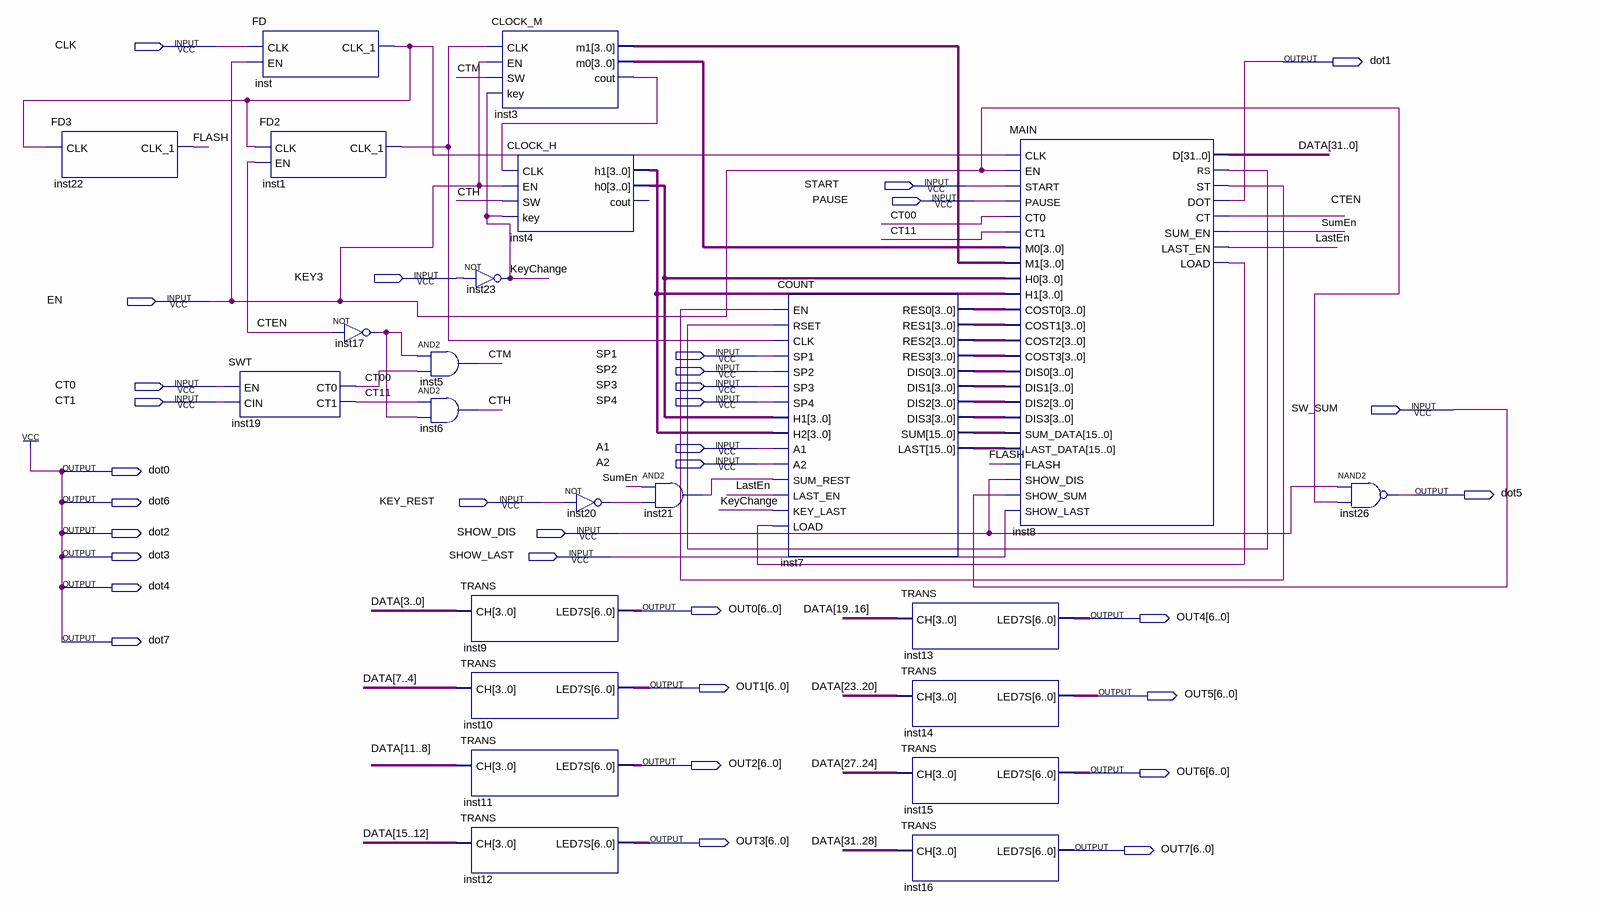
[diagram p0: schematic sheet]
// Quartus schematic taxi.bdf as structural Verilog: 23 symbols, 33 pins
module taxi (
  input  CLK,
  input  START,
  input  PAUSE,
  input  KEY3,
  input  EN,
  input  SP1,
  input  SP2,
  input  CT0,
  input  SP3,
  input  CT1,
  input  SP4,
  input  SW_SUM,
  input  A1,
  input  A2,
  input  KEY_REST,
  input  SHOW_DIS,
  input  SHOW_LAST,
  output dot1,
  output dot0,
  output dot5,
  output dot6,
  output dot2,
  output dot3,
  output dot4,
  output [6:0] OUT0,
  output [6:0] OUT4,
  output dot7,
  output [6:0] OUT1,
  output [6:0] OUT5,
  output [6:0] OUT2,
  output [6:0] OUT6,
  output [6:0] OUT3,
  output [6:0] OUT7
);

  wire CT00, CT11, CTEN, CTH, CTM, FLASH, inst1_clk_1, inst3_cout, inst8_load, inst8_rs, inst8_st,
       inst17_out, inst20_out, inst21_out, inst_clk_1, KeyChange, LastEn, SumEn;
  wire [3:0] inst3_m0, inst3_m1, inst4_h0, inst4_h1, inst7_dis0, inst7_dis1, inst7_dis2, inst7_dis3,
       inst7_res0, inst7_res1, inst7_res2, inst7_res3;
  wire [15:0] inst7_last, inst7_sum;
  wire [31:0] DATA;

  FD3 inst22 (.CLK(inst_clk_1), .CLK_1(FLASH));
  FD inst (.CLK(CLK), .EN(EN), .CLK_1(inst_clk_1));
  FD2 inst1 (.CLK(inst_clk_1), .EN(CTEN), .CLK_1(inst1_clk_1));
  SWT inst19 (.EN(CT0), .CIN(CT1), .CT0(CT00), .CT1(CT11));
  not inst17 (inst17_out, CTEN);
  and inst5 (CTM, inst17_out, CT00);
  and inst6 (CTH, CT11, inst17_out);
  CLOCK_M inst3 (
    .CLK(inst1_clk_1), .EN(EN), .SW(CTM), .key(KeyChange), .m1(inst3_m1), .m0(inst3_m0), .cout(inst3_cout));
  CLOCK_H inst4 (.CLK(inst3_cout), .EN(EN), .SW(CTH), .key(KeyChange), .h1(inst4_h1), .h0(inst4_h0));  // open: cout
  not inst23 (KeyChange, KEY3);
  TRANS inst9 (.CH(DATA[3:0]), .LED7S(OUT0));
  TRANS inst10 (.CH(DATA[7:4]), .LED7S(OUT1));
  TRANS inst11 (.CH(DATA[11:8]), .LED7S(OUT2));
  TRANS inst12 (.CH(DATA[15:12]), .LED7S(OUT3));
  not inst20 (inst20_out, KEY_REST);
  and inst21 (inst21_out, SumEn, inst20_out);
  COUNT inst7 (
    .EN(inst8_st), .RSET(inst8_rs), .CLK(inst1_clk_1), .SP1(SP1), .SP2(SP2), .SP3(SP3), .SP4(SP4),
    .H1(inst4_h0), .H2(inst4_h1), .A1(A1), .A2(A2), .SUM_REST(inst21_out), .LAST_EN(LastEn),
    .KEY_LAST(KeyChange), .LOAD(inst8_load), .RES0(inst7_res0), .RES1(inst7_res1), .RES2(inst7_res2),
    .RES3(inst7_res3), .DIS0(inst7_dis0), .DIS1(inst7_dis1), .DIS2(inst7_dis2), .DIS3(inst7_dis3),
    .SUM(inst7_sum), .LAST(inst7_last));
  TRANS inst13 (.CH(DATA[19:16]), .LED7S(OUT4));
  TRANS inst14 (.CH(DATA[23:20]), .LED7S(OUT5));
  TRANS inst15 (.CH(DATA[27:24]), .LED7S(OUT6));
  TRANS inst16 (.CH(DATA[31:28]), .LED7S(OUT7));
  MAIN inst8 (
    .CLK(inst_clk_1), .EN(EN), .START(START), .PAUSE(PAUSE), .CT0(CT00), .CT1(CT11), .M0(inst3_m0),
    .M1(inst3_m1), .H0(inst4_h0), .H1(inst4_h1), .COST0(inst7_res0), .COST1(inst7_res1), .COST2(inst7_res2),
    .COST3(inst7_res3), .DIS0(inst7_dis0), .DIS1(inst7_dis1), .DIS2(inst7_dis2), .DIS3(inst7_dis3),
    .SUM_DATA(inst7_sum), .LAST_DATA(inst7_last), .FLASH(FLASH), .SHOW_DIS(SHOW_DIS), .SHOW_SUM(SW_SUM),
    .SHOW_LAST(SHOW_LAST), .D(DATA), .RS(inst8_rs), .ST(inst8_st), .DOT(dot1), .CT(CTEN), .SUM_EN(SumEn),
    .LAST_EN(LastEn), .LOAD(inst8_load));
  nand inst26 (dot5, SHOW_DIS, EN);

  assign dot0 = 1'b1;
  assign dot2 = 1'b1;
  assign dot3 = 1'b1;
  assign dot4 = 1'b1;
  assign dot6 = 1'b1;
  assign dot7 = 1'b1;
endmodule
